# Altium schematic sheet SelfBalancingRB_SCH.SchDoc
size A4; SheetNumber: 1; SheetTotal: 1
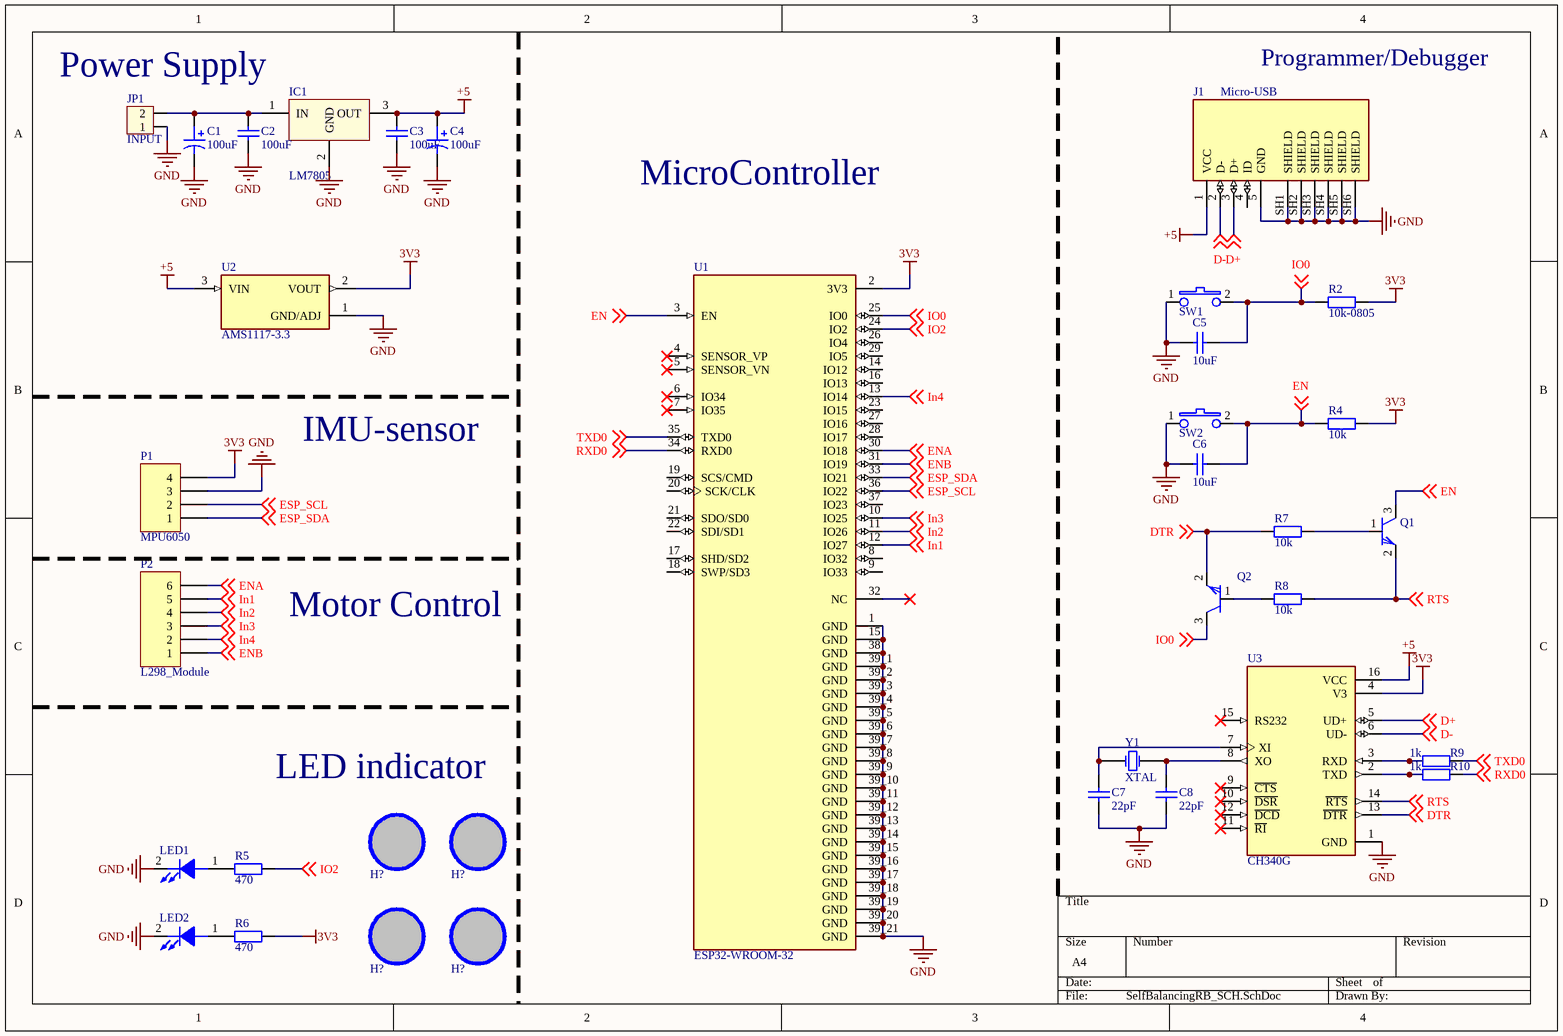
[diagram p0: SelfBalancingRB_SCH.SchDoc]

## Parts
(Parts that share a designator on the sheet are numbered #1, #2 ... from top to bottom, then left to right.)
C1  value 100uF  [RADIAL D]  (hidden comment: Cap Pol)
C2  value 100uF  [Cap Non-Pol 3mm]  (hidden comment: Cap Non-pol)
C3  value 100uF  [Cap Non-Pol 3mm]  (hidden comment: Cap Non-pol)
C4  value 100uF  [RADIAL D]  (hidden comment: Cap Pol)
C5  value 10uF  [C-NP-0805]  (hidden comment: Cap Non-pol)
C6  value 10uF  [C-NP-0805]  (hidden comment: Cap Non-pol)
C7  value 22pF  [C-NP-0805]  (hidden comment: Cap Non-pol)
C8  value 22pF  [C-NP-0805]  (hidden comment: Cap Non-pol)
H?#1  Hole  [LO KHOAN 3MM]  (value not drawn)
H?#2  Hole  [LO KHOAN 3MM]  (value not drawn)
H?#3  Hole  [LO KHOAN 3MM]  (value not drawn)
H?#4  Hole  [LO KHOAN 3MM]  (value not drawn)
IC1  LM7805  [QTO-220H3]
J1  Micro-USB  [AMPHENOL_10118194-0001LF]
JP1  INPUT  [CON2]
LED1  (no value)  [LED.SMD.RED]
LED2  (no value)  [LED.SMD.RED]
P1  MPU6050  [Header 4]
P2  L298_Module  [Header 6]
Q1  C1815  [SOT23N]  (value not drawn)
Q2  C1815  [SOT23N]  (value not drawn)
R2  value 10k-0805  [DIEN TRO 0805]  (hidden comment: RES_SMD_0805)
R4  value 10k  [DIEN TRO 0805]  (hidden comment: RES_SMD_0805)
R5  value 470  [DIEN TRO 0805]  (hidden comment: RES_SMD_0805)
R6  value 470  [DIEN TRO 0805]  (hidden comment: RES_SMD_0805)
R7  value 10k  [DIEN TRO 0805]  (hidden comment: RES_SMD_0805)
R8  value 10k  [DIEN TRO 0805]  (hidden comment: RES_SMD_0805)
R9  value 1k  [DIEN TRO 0805]  (hidden comment: RES_SMD_0805)
R10  value 1k  [DIEN TRO 0805]  (hidden comment: RES_SMD_0805)
SW1  PTS635  [TactSwitches.PTS635.SMT]  (value not drawn)
SW2  PTS635  [TactSwitches.PTS635.SMT]  (value not drawn)
U1  ESP32-WROOM-32  [MODULE_ESP32-WROOM-32]
U2  AMS1117-3.3  [SOT229P700X180-4N]
U3  CH340G  [SOIC127P600X180-16N]
Y1  XTAL  [XTAL]

## Nets
3V3: P1.4 R2.2 R4.2 R6.2 U1.2(3V3) U2.2(VOUT) U3.4(V3)
+5: C3.2 C4.1 IC1.3(OUT) J1.1(VCC) U2.3(VIN) U3.16(VCC)
GND: C1.2 C2.1 C3.1 C4.2 C5.1 C6.1 C7.1 C8.1 IC1.2(GND) J1.5(GND) J1.SH1(SHIELD) J1.SH2(SHIELD) J1.SH3(SHIELD) J1.SH4(SHIELD) J1.SH5(SHIELD) J1.SH6(SHIELD) JP1.1 LED1.2(K) LED2.2(K) P1.3 SW1.1 SW2.1 U1.1(GND) U1.15(GND) U1.38(GND) U1.39_1(GND) U1.39_2(GND) U1.39_3(GND) U1.39_4(GND) U1.39_5(GND) U1.39_6(GND) U1.39_7(GND) U1.39_8(GND) U1.39_9(GND) U1.39_10(GND) U1.39_11(GND) U1.39_12(GND) U1.39_13(GND) U1.39_14(GND) U1.39_15(GND) U1.39_16(GND) U1.39_17(GND) U1.39_18(GND) U1.39_19(GND) U1.39_20(GND) U1.39_21(GND) U2.1(GND/ADJ) U3.1(GND)
D+: J1.3(D+) U3.5(UD+) ; off-sheet D+
D-: J1.2(D-) U3.6(UD-) ; off-sheet D-
DTR: Q2.2(E) R7.1 U3.13(~{DTR}) ; off-sheet DTR
EN: C6.2 Q1.3(C) R4.1 SW2.2 U1.3(EN) ; off-sheet EN
ENA: P2.6 U1.30(IO18) ; off-sheet ENA
ENB: P2.1 U1.31(IO19) ; off-sheet ENB
ESP_SCL: P1.2 U1.36(IO22) ; off-sheet ESP_SCL
ESP_SDA: P1.1 U1.33(IO21) ; off-sheet ESP_SDA
In1: P2.5 U1.12(IO27) ; off-sheet In1
In2: P2.4 U1.11(IO26) ; off-sheet In2
In3: P2.3 U1.10(IO25) ; off-sheet In3
In4: P2.2 U1.13(IO14) ; off-sheet In4
IO0: C5.2 Q2.3(C) R2.1 SW1.2 U1.25(IO0) ; off-sheet IO0
IO2: R5.2 U1.24(IO2) ; off-sheet IO2
RTS: Q1.2(E) R8.2 U3.14(~{RTS}) ; off-sheet RTS
RXD0: R10.2 U1.34(RXD0) ; off-sheet RXD0
TXD0: R9.2 U1.35(TXD0) ; off-sheet TXD0
NetC1_1: C1.1 C2.2 IC1.1(IN) JP1.2
NetC7_2: C7.2 U3.7(XI) Y1.2(OSC2)
NetC8_2: C8.2 U3.8(XO) Y1.1(OSC1)
NetLED1_1: LED1.1(A) R5.1
NetLED2_1: LED2.1(A) R6.1
NetQ1_1: Q1.1(B) R7.2
NetQ2_1: Q2.1(B) R8.1
NetR9_1: R9.1 U3.3(RXD)
NetR10_1: R10.1 U3.2(TXD)

Not connected (* = marked no-connect by the designer): H?#1 1; H?#2 1; H?#3 1; H?#4 1; J1 4(ID); U1 4(SENSOR_VP)* 5(SENSOR_VN)* 6(IO34)* 7(IO35)* 8(IO32) 9(IO33) 14(IO12) 16(IO13) 17(SHD/SD2) 18(SWP/SD3) 19(SCS/CMD) 20(SCK/CLK) 21(SDO/SD0) 22(SDI/SD1) 23(IO15) 26(IO4) 27(IO16) 28(IO17) 29(IO5) 32(NC)* 37(IO23); U3 9(~{CTS})* 10(~{DSR})* 11(~{RI})* 12(~{DCD})* 15(RS232)*

## Notes on the sheet
- Power Supply
- Programmer/Debugger
- MicroController
- IMU-sensor
- Motor Control
- LED indicator

## Library data of the parts
C1 C4 = Cap Pol: Polarized Capacitor; Published: 8-Jun-2000; LatestRevisionDate: 17-Jul-2002; LatestRevisionNote: Re-released for DXP Platform.; PackageReference: POLAR0.8; Publisher: Altium Limited
C2 C3 C5-C8 = Cap Non-pol: Non-polarized Capacitor; Published: 8-Jun-2000; LatestRevisionDate: 17-Jul-2002; LatestRevisionNote: Re-released for DXP Platform.; PackageReference: RAD-0.3; Publisher: Altium Limited
H?#1-H?#4 = Hole: Hole 3mm
IC1 = LM78xx_1: On ap +, from + 5 to + 24VDC; Value: LM7805
J1 = 10118194-0001LF: Micro USB, Input Output Connectors, B TYPE RECEPTACLE with flange; MF: Amphenol ICC; SnapEDA_Link: https://www.snapeda.com/parts/10118194-0001LF/Amphenol+FCI/view-part/?ref=snap; Package: None; Value: *; MP: 10118194-0001LF; Check_prices: https://www.snapeda.com/parts/10118194-0001LF/Amphenol+FCI/view-part/?ref=eda
JP1 = Con2: Connector 2; Value: Connector 2
LED1 LED2 = LED_1: Typical GaAs SMD LED; Manufacturer: Lite-On Inc; Color: RED; Type: Cong ty RP; Vendor: Digikey; Publisher: Hoang Nguyen; Price: *; Published: 13-April-2009; ComponentLink1Description: Digikey Part Link; ComponentLink2Description: Open Datasheet; ComponentLink2URL: H:\LIBRARY\LIBRARY.Datasheet\
P1 = Header 4: Header, 4-Pin; LatestRevisionDate: 17-Jul-2002; LatestRevisionNote: Re-released for DXP Platform.; Publisher: Altium Limited
P2 = Header 6: Header, 6-Pin; LatestRevisionDate: 17-Jul-2002; LatestRevisionNote: Re-released for DXP Platform.; Publisher: Altium Limited
Q1 Q2 = C1815: Q2SC1815; PSpiceTemplate: Q^@REFDES %c %b %e @MODEL; Vendor: Digikey; COMPONENT: 2SC1815; Published: 13-April-2009; Publisher: Hoang Nguyen; ComponentLink1Description: Digikey Part Link; ComponentLink2Description: Open Datasheet; ComponentLink2URL: H:\LIBRARY\LIBRARY.Datasheet\; Price: 500VND
R2 R4-R10 = RES_SMD_0805: RES_0805; Published: 8-Jun-2000; LatestRevisionDate: 17-Jul-2002; LatestRevisionNote: Re-released for DXP Platform.; PackageReference: AXIAL-0.4; Publisher: Altium Limited
SW1 SW2 = SW TACT MOM SPST: SWITCH TACT MOM SPST SMD; Manufacturer: C&K Components; Manufacturer P/N: PTS635SL25SMTR LFS; Vendor: Digikey; Vendor P/N: CKN9119CT-ND; ComponentLink1URL: http://search.digikey.com/scripts/DkSearch/dksus.dll?Detail&name=CKN1573CT-ND; ComponentLink2URL: H:\LIBRARY\LIBRARY.Datasheet\SBLCDA4_Specification.pdf; ComponentLink1Description: Digikey Part Link; ComponentLink2Description: Open Datasheet; Publisher: Hoang Nguyen; Published: 13-April-2009
U1 = ESP32-WROOM-32: Bluetooth, WiFi 802.11b/g/n, Bluetooth v4.2 +EDR, Class 1, 2 and 3 Transceiver Module 2.4GHz ~ 2.5GHz Antenna Not Included, U.FL Surface Mount; MF: Espressif Systems; Price: None; Availability: In Stock; MP: ESP32-WROOM-32; Package: Module Espressif Systems; SnapEDA_Link: https://www.snapeda.com/parts/ESP32-WROOM-32/Espressif+Systems/view-part/?ref=snap; Check_prices: https://www.snapeda.com/parts/ESP32-WROOM-32/Espressif+Systems/view-part/?ref=eda; Value: *; Purchase-URL: https://pricing.snapeda.com/search/part/ESP32-WROOM-32/?ref=eda
U2 = AMS1117-3.3: Sot223/Pkg 1-Amp 3.3-Volt Low Drop Out Voltage Regulatator; MF: Advanced Monolithic Systems; Package: SOT-223 Seeed Technology; Value: *; Check_prices: https://www.snapeda.com/parts/AMS1117-3.3/Advanced+Monolithic+Systems/view-part/?ref=eda; Price: None; Availability: Not in stock; MP: AMS1117-3.3; SnapEDA_Link: https://www.snapeda.com/parts/AMS1117-3.3/Advanced+Monolithic+Systems/view-part/?ref=snap
U3 = CH340G: USB Interface Integrated Circuit; MF: WCH; Value: *; SnapEDA_Link: https://www.snapeda.com/parts/Ch340G/WCH/view-part/?ref=snap; MP: Ch340G; Check_prices: https://www.snapeda.com/parts/Ch340G/WCH/view-part/?ref=eda; Availability: Not in stock; Price: None; Package: None
Y1 = XTAL: Crystal Oscillator; Published: 8-Jun-2000; LatestRevisionDate: 17-Jul-2002; LatestRevisionNote: Re-released for DXP Platform.; PackageReference: R38; Publisher: Altium Limited